# Altium schematic sheet SIPO.SchDoc: Rejestry SIPO
size A4; Author: Jakub Wiczynski; Revision: 1
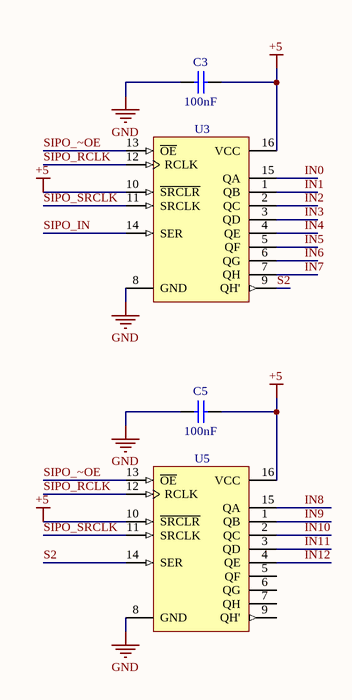
[diagram p0: SIPO.SchDoc]

## Parts
C3  value 100nF  [C1206]  (hidden comment: http://www.tme.eu/pl/details/12061c104kat2a/kondensatory-mlcc-smd-1206/avx/)
C5  value 100nF  [C1206]  (hidden comment: http://www.tme.eu/pl/details/12061c104kat2a/kondensatory-mlcc-smd-1206/avx/)
U3  http://www.tme.eu/pl/details/sn74hc595d/rejestry-przesuwne/texas-instruments/  [SOIC16_N]  (value not drawn)
U5  http://www.tme.eu/pl/details/sn74hc595d/rejestry-przesuwne/texas-instruments/  [SOIC16_N]  (value not drawn)

## Nets
+5: C3.2 C5.2 U3.10(~{SRCLR}) U3.16(VCC) U5.10(~{SRCLR}) U5.16(VCC)
GND: C3.1 C5.1 U3.8(GND) U5.8(GND)
IN0: U3.15(QA)
IN1: U3.1(QB)
IN2: U3.2(QC)
IN3: U3.3(QD)
IN4: U3.4(QE)
IN5: U3.5(QF)
IN6: U3.6(QG)
IN7: U3.7(QH)
IN8: U5.15(QA)
IN9: U5.1(QB)
IN10: U5.2(QC)
IN11: U5.3(QD)
IN12: U5.4(QE)
S2: U3.9(QH') U5.14(SER)
SIPO_IN: U3.14(SER)
SIPO_RCLK: U3.12(RCLK) U5.12(RCLK)
SIPO_SRCLK: U3.11(SRCLK) U5.11(SRCLK)
SIPO_~OE: U3.13(~{OE}) U5.13(~{OE})

Not connected (* = marked no-connect by the designer): U5 5(QF) 6(QG) 7(QH) 9(QH')

## Notes on the sheet
- Title:
- Author:
- Approved by:
- Size:
- A4
- Date:
- Revision:

## Library data of the parts
C3 C5 = Cap: 100nF; Published: 8-Jun-2000; LatestRevisionDate: 17-Jul-2002; LatestRevisionNote: Re-released for DXP Platform.; PackageReference: RAD-0.3; Publisher: Altium Limited; PackageDescription: Radial Cap, Thru-Hole; 2 Leads; 0.3 in Pin Spacing
U3 U5 = SN74HC595N: SN74HC595; Published: 8-Jun-2000; LatestRevisionDate: 04-Mar-2005; LatestRevisionNote: Stylized 3D Model Added.; DatasheetVersion: May-1997; PackageVersion: Oct-1995; PackageReference: N016; Publisher: Altium Limited; PackageDescription: DIP; 16 Leads; Row Spacing 7.62 mm; Pitch 2.54 mm; Code_JEDEC: MS-001-BB; ComponentLink1Description: Manufacturer Link; ComponentLink1URL: http://www.ti.com/; ComponentLink2Description: Datasheet; ComponentLink2URL: http://www-s.ti.com/sc/ds/sn74hc595.pdf